# Altium schematic sheet Sheet2.SchDoc
size A
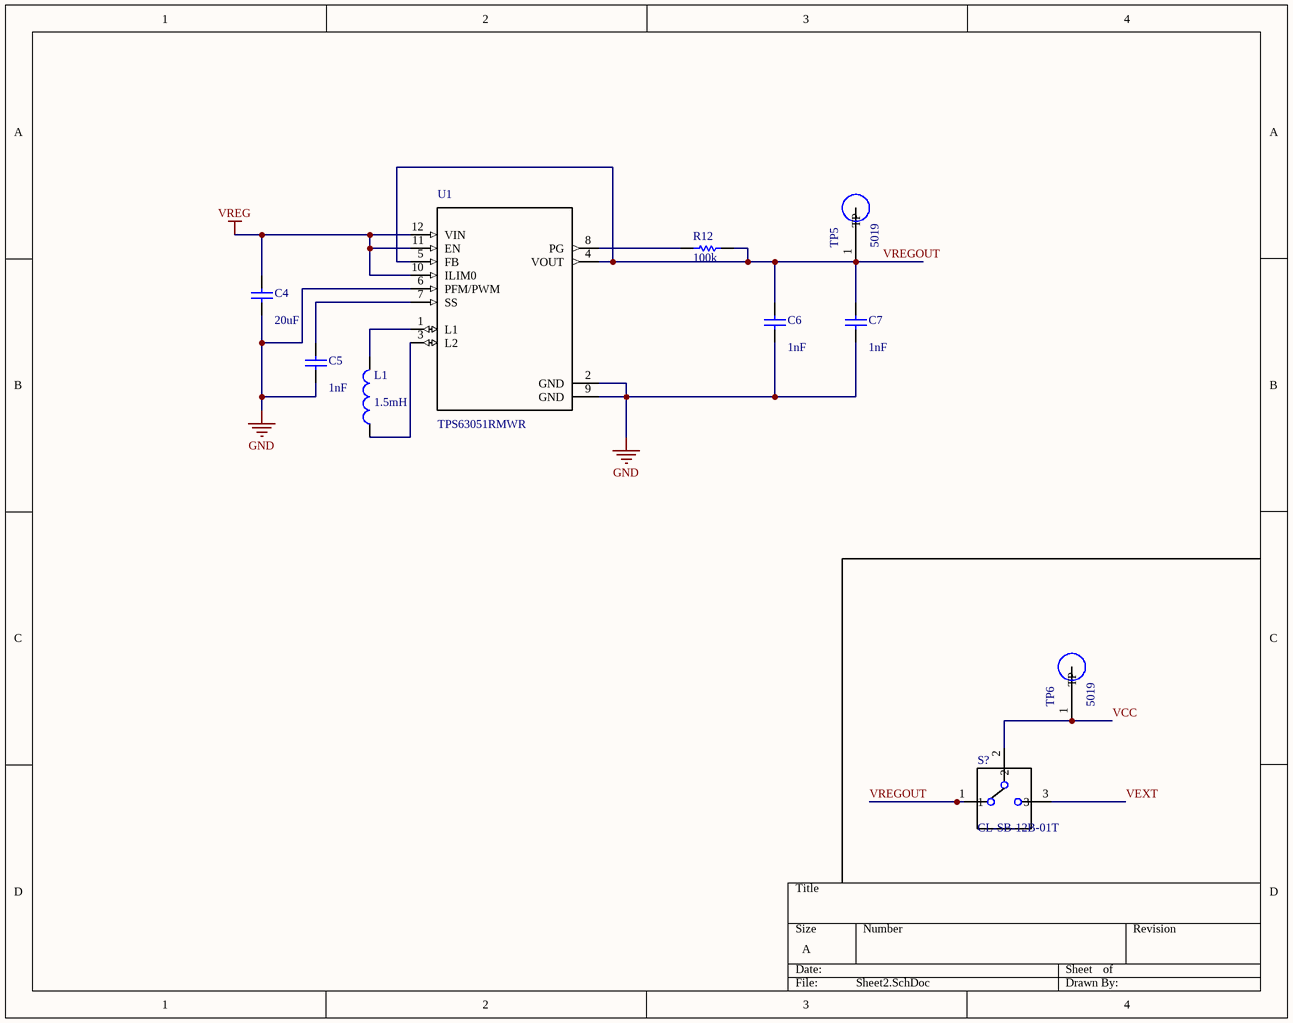
[diagram p0: Sheet2.SchDoc]

## Parts
C4  value 20uF  [1608[0603]]  (hidden comment: Cap)
C5  value 1nF  [1608[0603]]  (hidden comment: Cap)
C6  value 1nF  [1608[0603]]  (hidden comment: Cap)
C7  value 1nF  [1608[0603]]  (hidden comment: Cap)
L1  value 1.5mH  [0402-A]  (hidden comment: Inductor)
R12  value 100k  [1608[0603]]  (hidden comment: Res1)
S?  CL-SB-12B-01T  [*CL-SB-12B]
TP5  5019  [*TP380X203]
TP6  5019  [*TP380X203]
U1  TPS63051RMWR  [*QFN50P250X250X100-12N]

## Nets
GND: C4.1 C5.1 C6.1 C7.1 U1.2(GND) U1.6(PFM/PWM) U1.9(GND)
VREG: C4.2 U1.10(ILIM0) U1.11(EN) U1.12(VIN)
VCC: S?.2 TP6.1(TP)
VEXT: S?.3
VREGOUT: C6.2 C7.2 R12.1 S?.1 TP5.1(TP) U1.4(VOUT) U1.5(FB)
NetC5_2: C5.2 U1.7(SS)
NetL1_1: L1.1 U1.3(L2)
NetL1_2: L1.2 U1.1(L1)
NetR12_2: R12.2 U1.8(PG)

## Library data of the parts
C4-C7 = Cap: 10000pF ±10% 50V Ceramic Capacitor X7R 0603 (1608 Metric); Manufacturer: Samsung Electro-Mechanics; Manufacturer Part Number: CL10B103KB8NNNC; Digi-Key Part Number: 1276-1009-1-ND; digi key link url: https://www.digikey.com/product-detail/en/samsung-electro-mechanics/CL10B103KB8NNNC/1276-1009-1-ND/3889095
R12 = Res1: 10 kOhms ±1% 0.125W, 1/8W Chip Resistor 0603 (1608 Metric) Anti-Sulfur, Moisture Resistant Thin Film; Manufacturer: Stackpole Electronics Inc; Manufacturer Part Number: RNCP0603FTD10K0; Digi-Key Part Number: RNCP0603FTD10K0CT-ND; digi key link url: https://www.digikey.com/product-detail/en/stackpole-electronics-inc/RNCP0603FTD10K0/RNCP0603FTD10K0CT-ND/2240478
S? = CL-SB-12B-01T: Switch Slide N.O./N.C. SPDT Top Slide 0.2A 12VDC Gull Wing SMD T/R; MF: Nidec Copal; SnapEDA_Link: https://www.snapeda.com/parts/CL-SB-12B-01T/Nidec%20Copal%20Electronics/view-part/?ref=snap; Availability: Unavailable; Price: None; MP: CL-SB-12B-01T; Package: None; Value: *
TP5 TP6 = 5019: Phosphor Bronze Contact Miniature Silver Plated Surface Mount Test Points; MF: Keystone Electronics; Package: 2010 Keystone; Price: None; Availability: Unavailable; MP: 5019; SnapEDA_Link: https://www.snapeda.com/parts/5019/Keystone%20Electronics/view-part/?ref=snap; Value: *
U1 = TPS63051RMWR: Tiny Single Inductor Buck Boost Converter 12-VQFN -40 to 85; MF: Texas Instruments; Package: VQFN-12 Texas Instruments; Price: None; Availability: Unavailable; MP: TPS63051RMWR; SnapEDA_Link: https://www.snapeda.com/parts/TPS63051RMWR/Texas%20Instruments/view-part/?ref=snap; Value: *